# EAGLE design bpcb (EAGLE 5.04)
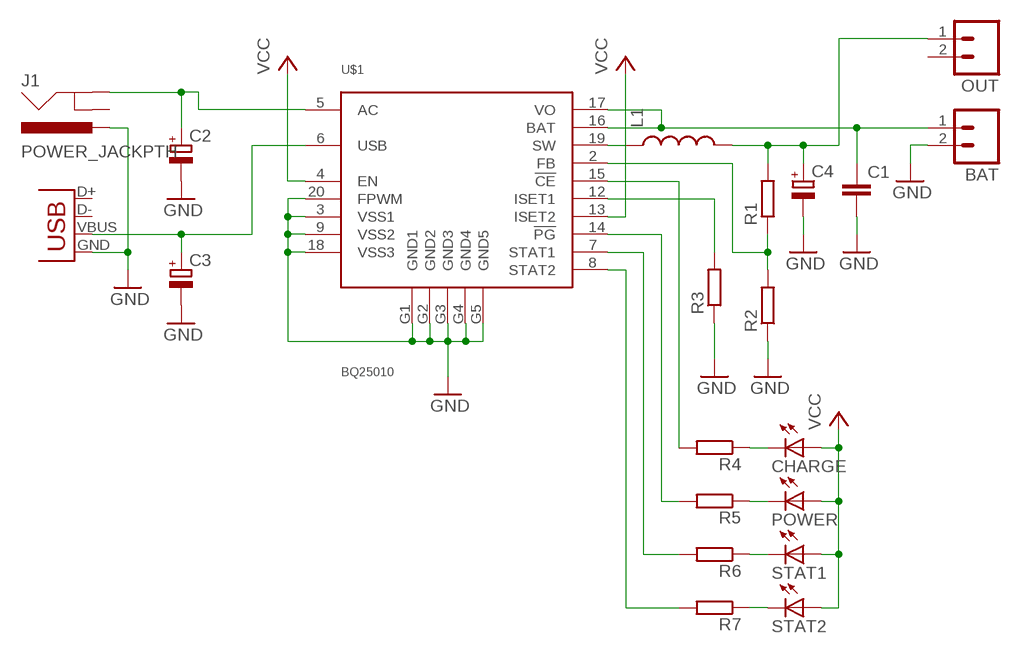
[diagram p0: schematic, sheet 1]

## Parts
BAT  M02LOCK  [1X02_LOCK]
C1  C-EUC0603  [C0603]
C2  CPOL-EUD  [PANASONIC_D]
C3  CPOL-EUD  [PANASONIC_D]
C4  CPOL-EUD  [PANASONIC_D]
CHARGE  LEDCHIPLED_0603  [CHIPLED_0603]
J1  POWER_JACKPTH  [POWER_JACK_PTH]
L1  INDUCTORCDRH62B  [CDRH62BNP-470MC]
OUT  M02LOCK  [1X02_LOCK]
POWER  LEDCHIPLED_0603  [CHIPLED_0603]
R1  R-EU_R0603  [R0603]
R2  R-EU_R0603  [R0603]
R3  R-EU_R0603  [R0603]
R4  R-EU_R0603  [R0603]
R5  R-EU_R0603  [R0603]
R6  R-EU_R0603  [R0603]
R7  R-EU_R0603  [R0603]
STAT1  LEDCHIPLED_0603  [CHIPLED_0603]
STAT2  LEDCHIPLED_0603  [CHIPLED_0603]
U$1  BQ25010  [PQFP20]
X1  USBSMD  [USB-MINIB]

## Nets
GND: BAT.2 C1.2 C2.- C3.- C4.- J1.PWR R2.1 R3.1 U$1.3(VSS1) U$1.9(VSS2) U$1.18(VSS3) U$1.20(FPWM) U$1.G1(GND1) U$1.G2(GND2) U$1.G3(GND3) U$1.G4(GND4) U$1.G5(GND5) X1.GND
N$1: R1.1 R2.2 U$1.2(FB)
N$2: BAT.1 C1.1 U$1.16(BAT) U$1.17(VO)
N$3: L1.P$1 U$1.19(SW)
N$4: C4.+ L1.P$2 OUT.1 R1.2
N$5: C3.+ U$1.6(USB) X1.VBUS
N$6: C2.+ J1.GND U$1.5(AC)
N$7: CHARGE.C R4.1
N$8: R3.2 U$1.12(ISET1)
N$9: POWER.C R5.1
N$10: R4.2 U$1.15(!CE)
N$11: R5.2 U$1.14(!PG)
N$12: R6.1 STAT1.C
N$13: R7.1 STAT2.C
N$14: R6.2 U$1.7(STAT1)
N$15: R7.2 U$1.8(STAT2)
VCC: CHARGE.A POWER.A STAT1.A STAT2.A U$1.4(EN) U$1.13(ISET2)
Unconnected: J1.GNDBREAK OUT.2 X1.D+ X1.D-

## Library data of the parts
BAT OUT = SparkFun:M02: Header 2 Standard 2-pin 0.1" header. Use with straight break away headers (SKU : PRT-00116), right angle break away headers (PRT-00553), swiss pins (PRT-00743), machine pins (PRT-00117), and female headers (PRT-00115). Molex polarized connector foot print use with SKU : PRT-08233 with associated crimp pins and housings.
C1 = rcl:C-EU: CAPACITOR, European symbol
C2-C4 = rcl:CPOL-EU: POLARIZED CAPACITOR, European symbol
CHARGE POWER STAT1 STAT2 = led:LED: LED OSRAM: - CHIPLED LG R971, LG N971, LY N971, LG Q971, LY Q971, LO R971, LY R971 LH N974, LH R974 LS Q976, LO Q976, LY Q976 LO Q996 - Hyper CHIPLED LW Q18S LB Q993, LB Q99A, LB R99A - SideLED LS A670, LO A670, LY A670, LG A670, LP A670 LB A673, LV A673, LT A673, LW A673 LH A674 LY A675 LS A676, LA A676, LO A676, LY A676, LW A676 LS A679, LY A679, LG A679 - Hyper Micro SIDELED® LS Y876, LA Y876, LO Y876, LY Y876 LT Y87S - SmartLED LW L88C, LW L88S LB L89C, LB L89S, LG L890 LS L89K, LO L89K, LY L89K LS L896, LA L896, LO L896, LY L896 - TOPLED LS T670, LO T670, LY T670, LG T670, LP T670 LSG T670, LSP T670, LSY T670, LOP T670, LYG T670 LG T671, LOG T671, LSG T671 LB T673, LV T673, LT T673, LW T673 LH T674 LS T676, LA T676, LO T676, LY T676, LB T676, LH T676, LSB T676, LW T676 LB T67C, LV T67C, LT T67C, LS T67K, LO T67K, LY T67K, LW E67C LS E67B, LA E67B, LO E67B, LY E67B, LB E67C, LV E67C, LT E67C LW T67C LS T679, LY T679, LG T679 LS T770, LO T770, LY T770, LG T770, LP T770 LB T773, LV T773, LT T773, LW T773 LH T774 LS E675, LA E675, LY E675, LS T675 LS T776, LA T776, LO T776, LY T776, LB T776 LHGB T686 LT T68C, LB T68C - Hyper Mini TOPLED® LB M676 - Mini TOPLED Santana® LG M470 LS M47K, LO M47K, LY M47K Source: http://www.osram.convergy.de/
J1 = SparkFun:POWER_JACK: Power Jack This is the standard 5.5mm barrel jack for power. The PTH is the most common, proven, reliable, footprint. All others are experimental. The Slot footprint only works if the mill layer is transmitted to the PCB fab house so be warned. Spark Fun Electronics SKU : PRT-00119. Mating wall wart : TOL-00298 (and others)
L1 = additional:INDUCTOR: Inductors Basic Inductor/Choke - 0603 and 1206. Footprints are not proven and vary greatly between part numbers.
R1-R7 = rcl:R-EU_: RESISTOR, European symbol
U$1 = additional:BQ25010
X1 = SparkFun:USB: USB Connectors USB-B-PTH is fully proven SKU : PRT-00139 USB-miniB is fully proven SKU : PRT-00587 USB-A-PCB is untested. USB-A-H is throughly reviewed, but untested. Spark Fun Electronics SKU : PRT-00437 USB-B-SMT is throughly reviewed, but untested. Needs silkscreen touching up. USB-A-S has not been used/tested USB-MB-H has not been used/tested

## Board
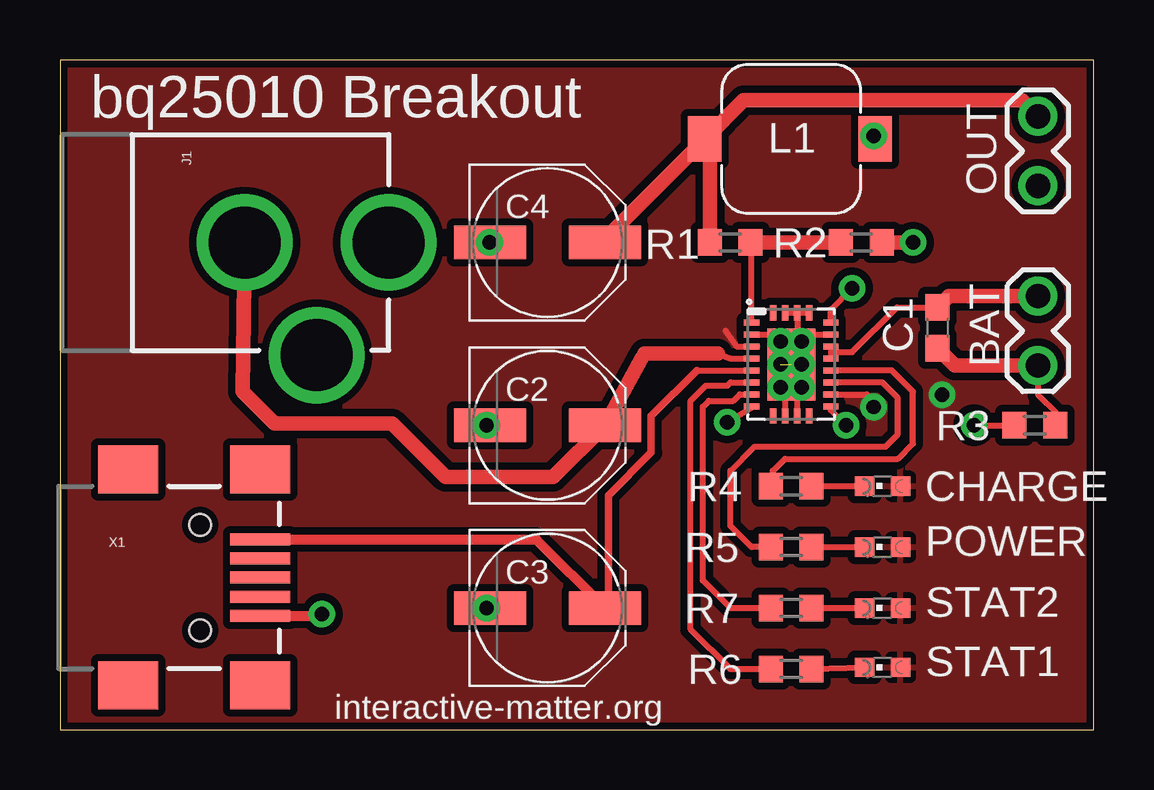
[diagram p1: board, top side]
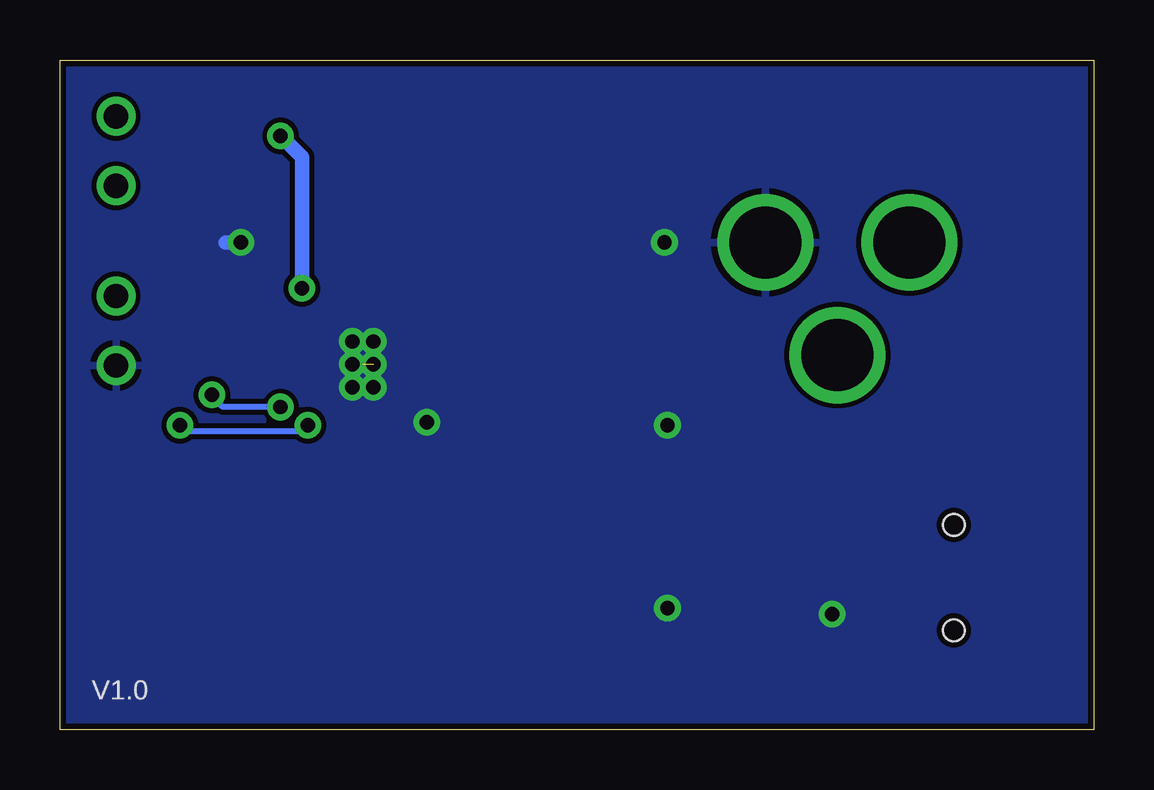
[diagram p2: board, bottom side, seen from below]

Size 43.1 x 27.93 mm. Coordinates in mm from the lower left corner, seen from the top.
Outline: 0,0 43.1,0 43.1,27.93 0,27.93 0,0
Copper layers (1*16): Top 0.035mm / dielectric 1.5mm / Bottom 0.035mm
Design rules "SparkFun": minimum track width 8mil, minimum drill 20mil, track to track 8mil, track to pad 8mil, pad to pad 8mil, via to via 8mil, smd to smd 0mil, copper to edge 10mil, drill to drill 8mil, minimum pad ring 12mil, minimum via ring 10mil, stop-mask expansion 4mil, vias tented up to drill 25mil, thermal gap 10mil

### Footprints (pad centres in the part's own frame; a part is rotated, then mirrored left to right if it is on the bottom)
1X02_LOCK = drill 1.016 round: 1 -0.178,0; 2 2.718,0
C0603 = smd 1.1 x 1: 1 -0.85,0; 2 0.85,0
PANASONIC_D = smd 3 x 1.4: + 2.4,0; - -2.4,0
CHIPLED_0603 = smd 0.8 x 0.8: A 0,-0.75; C 0,0.75
POWER_JACK_PTH = drill 2.997 round: GND 0,7.7; GNDBREAK 4.7,10.7; PWR 0,13.7
CDRH62BNP-470MC = smd 1.9 x 1.4: P$1 0,-3.5; P$2 0,3.6
R0603 = smd 1 x 1.1: 1 -0.85,0; 2 0.85,0
PQFP20 = smd 0.635 x 0.254: 1 -2.15,-0.75; 10 2.15,-0.75; 11 2.15,0.75; 20 -2.15,0.75; G1 2.15,-0.25; G2 2.15,0.25; G3 -2.15,0.25; G4 -2.15,-0.25 | smd 0.254 x 0.635: 2 -1.75,-1.65; 3 -1.25,-1.65; 4 -0.75,-1.65; 5 -0.25,-1.65; 6 0.25,-1.65; 7 0.75,-1.65; 8 1.25,-1.65; 9 1.75,-1.65; 12 1.75,1.65; 13 1.25,1.65; 14 0.75,1.65; 15 0.25,1.65; 16 -0.25,1.65; 17 -0.75,1.65; 18 -1.25,1.65; 19 -1.75,1.65 | smd 3 x 2: G5 0,0
USB-MINIB = smd 2.5 x 0.5: D+ 2.5,0; D- 2.5,0.8; GND 2.5,-1.6; ID 2.5,-0.8; VBUS 2.5,1.6 | smd 2.5 x 2: GND@1 -3,-4.5; GND@2 -3,4.5; GND@3 2.5,4.5; GND@4 2.5,-4.5 | hole 0.9: 0,2.2; 0,-2.2

### Placement (x,y rotation side)
BAT  40.77,17.91 270 top
C1  36.58,16.76 270 top
C2  20.32,12.7 0 top
C3  20.32,5.08 0 top
C4  20.32,20.32 0 top
CHARGE  34.29,10.16 90 top
J1  0,20.32 270 top
L1  30.48,24.64 90 top
OUT  40.77,25.4 270 top
POWER  34.29,7.62 90 top
R1  27.94,20.32 180 top
R2  33.4,20.32 180 top
R3  40.64,12.7 180 top
R4  30.48,10.16 180 top
R5  30.48,7.62 180 top
R6  30.48,2.54 180 top
R7  30.48,5.08 180 top
STAT1  34.29,2.6 90 top
STAT2  34.29,5.08 90 top
U$1  30.48,15.24 270 top
X1  5.84,6.35 0 top

### Tracks (layer width: path | path; a pad name or v marks a point on that pad's centre or on a via)
GND  (via drill 0.6)  (1 unrouted)
  Top 0.254: U$1.18 31.22,16.49 v30.92,16.19 30.73,16.51 U$1.G3 | U$1.3 29.74,16.49 v30.04,16.19 | 29.97,14.1 v30.04,14.29 30.23,13.97 U$1.G1 | U$1.9 28.86,13.46 v27.81,12.83 | U$1.G2 30.73,13.97 v30.92,14.29 | R3.1 41.53,13.21 40.77,13.97 BAT.2 | C2.- v17.78,12.7 | C4.- v17.91,20.32 | C3.- v17.78,5.08 | U$1.G4 U$1.G3 | U$1.G3 U$1.20
  Top 0.406: X1.GND 10.67,4.75 v10.92,4.83
  Top 0.61: BAT.2 37.3,15.19 C1.2 | R2.1 v35.56,20.32
  Bottom 0.254: v27.81,12.83 27.94,13.08
  Bottom 0.61: v35.56,20.32 36.2,20.32
  other vias: 30.92,15.24 30.04,15.24
  pour Bottom: -0.38,28.32 53.72,28.32 53.72,-0.38 -0.38,-0.38
N$1
  Top 0.254: U$1.2 28.83,20.28 R1.1
  Top 0.61: R1.1 R2.2
N$2
  Top 0.254: C1.1 34.89,17.61 33.02,15.75 32.37,15.75 U$1.17 U$1.16
  Top 0.61: BAT.1 37.05,18.09 C1.1
N$3  (via drill 0.6)
  Top 0.254: U$1.19 32.13,17.52 v33.02,18.41
  Top 0.61: v33.91,24.77 33.78,24.44 L1.P$1
  Bottom 0.61: v33.02,18.41 33.02,23.88 v33.91,24.77
N$4
  Top 0.61: OUT.1 40.09,26.25 28.49,26.25 L1.P$2 | C4.+ 22.82,20.57 L1.P$2 | R1.2 27.09,24.43 L1.P$2
N$5
  Top 0.254: 26.55,14.99 U$1.6
  Top 0.305: 26.55,14.99 24.64,13.08 24.64,11.56 22.86,9.78 22.86,5.22 C3.+
  Top 0.406: X1.VBUS 19.85,7.95 C3.+
N$6
  Top 0.254: U$1.5 27.94,15.49 27.43,15.68 | 24.24,15.49 24.37,15.68
  Top 0.61: J1.GND 7.62,14.1 8.95,12.76 13.84,12.76 16.07,10.54 20.56,10.54 C2.+ 24.24,15.49 | 24.37,15.68 27.43,15.68
N$7
  Top 0.254: R4.1 CHARGE.C
N$8  (via drill 0.6)
  Top 0.254: U$1.12 32.13,13.34 v32.77,12.7 | v38.1,12.7 R3.2
  Bottom 0.254: v32.77,12.7 32.83,12.7 33.08,12.45 37.72,12.45 38.04,12.7 v38.1,12.7
N$9
  Top 0.254: R5.1 POWER.C
N$10
  Top 0.254: U$1.15 34.67,14.99 35.56,14.1 35.56,11.94 34.92,11.3 30.23,11.3 29.72,10.79 29.72,10.25 R4.2
N$11
  Top 0.254: U$1.14 34.28,14.49 34.92,13.84 34.92,12.32 34.42,11.81 28.96,11.81 27.94,10.79 27.94,8.51 28.83,7.62 R5.2
N$12
  Top 0.254: R6.1 STAT1.C
N$13
  Top 0.254: R7.1 STAT2.C
N$14
  Top 0.254: R6.2 27.94,2.54 26.29,4.19 26.29,13.72 26.92,14.35 27.81,14.35 27.95,14.49 U$1.7
N$15
  Top 0.254: R7.2 27.94,5.08 26.8,6.22 26.8,13.46 27.05,13.72 28.07,13.72 28.34,13.99 U$1.8
VCC  (via drill 0.6)
  Top 0.254: U$1.4 28.21,15.99 27.75,16.64 | U$1.13 33.63,13.99 v33.91,13.46 | v36.77,13.97 36.83,14.35
  Bottom 0.254: v33.91,13.46 36.32,13.46 v36.77,13.97
  pour Top (isolate 0.305): -0.51,28.32 53.72,28.32 53.72,-0.38 -0.38,-0.38

### Text on the board
tNames: bq25010 Breakout | interactive-matter.org
bNames: V1.0